# Altium project Mando_V0.PrjPcb
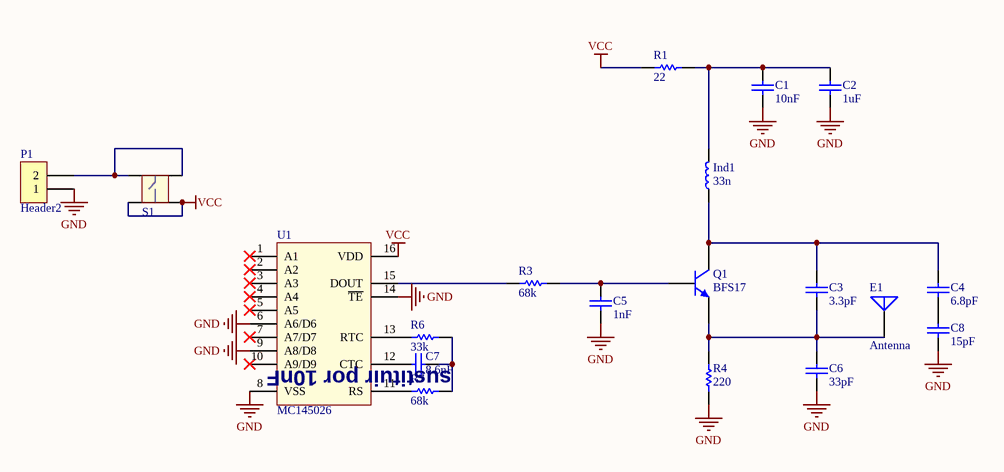
[diagram p0: Mando_v0.SchDoc]
1 sheet, 19 parts. Net scope: global (net labels, ports and power ports of the same name join across sheets).
Board file: Mando_v0.PcbDoc

## Sheet Mando_v0.SchDoc
size A4

### Parts
C1  value 10nF  [0805_CAP]  (hidden comment: Capacitor)
C2  value 1uF  [0805_CAP]  (hidden comment: Capacitor)
C3  value 3.3pF  [0805_CAP]  (hidden comment: Capacitor)
C4  value 6.8pF  [0805_CAP]  (hidden comment: Capacitor)
C5  value 1nF  [0805_CAP]  (hidden comment: Capacitor)
C6  value 33pF  [0805_CAP]  (hidden comment: Capacitor)
C7  value 8.6nF  [CAP0805]  (hidden comment: Capacitor)
C8  value 15pF  [CAP0805]  (hidden comment: Capacitor)
E1  Antenna  [PIN1]
Ind1  Valor: 33n  [IND0603]  (hidden comment: Ind2)
P1  Header2  [HeaderHx2]
Q1  BFS17  [SOT23]
R1  value 22  [0805_RES]  (hidden comment: Resistor)
R3  value 68k  [0805_RES]  (hidden comment: Resistor)
R4  value 220  [0805_RES]  (hidden comment: Resistor)
R6  value 33k  [RES0805]  (hidden comment: Resistor)
R7  value 68k  [RES0805]  (hidden comment: Resistor)
S1  Pulsador  [SW-PB6mm]  (value not drawn)
U1  MC145026  [SOIC127P602-16BN]

### Nets
GND: C1.1 C2.1 C5.1 C6.1 C8.1 P1.1 R4.2 U1.6(A6/D6) U1.8(VSS) U1.9(A8/D8) U1.14(~{TE})
VCC: R1.1 S1.3 S1.4 U1.16(VDD)
NetC1_2: C1.2 C2.2 Ind1.2 R1.2
NetC3_1: C3.1 C6.2 E1.1(A) Q1.2(E) R4.1
NetC3_2: C3.2 C4.2 Ind1.1 Q1.3(C)
NetC4_1: C4.1 C8.2
NetC5_2: C5.2 Q1.1(B) R3.2
NetC7_1: C7.1 R6.2 R7.2
NetC7_2: C7.2 U1.12(CTC)
NetP1_2: P1.2 S1.1 S1.2
NetR3_1: R3.1 U1.15(DOUT)
NetR6_1: R6.1 U1.13(RTC)
NetR7_1: R7.1 U1.11(RS)

Not connected (* = marked no-connect by the designer): U1 1(A1)* 2(A2)* 3(A3)* 4(A4)* 5(A5)* 7(A7/D7)* 10(A9/D9)*

### Notes on the sheet
- (near R7) sustituir por 10nF

### Library data of the parts
C1-C8 = Cap
E1 = Antenna: Generic Antenna; Published: 24-Mar-1999; LatestRevisionDate: 17-Jul-2002; LatestRevisionNote: Re-released for DXP Platform.; PackageReference: PIN1; Publisher: Altium Limited
Q1 = BFS17: NPN 1 GHz Wideband Transistor; Published: 17-Sep-2003; LatestRevisionDate: 12-Dec-2006; LatestRevisionNote: IPC-7351 Footprint Added.; DatasheetVersion: Sep-1995; PackageVersion: May-1999; PackageReference: SOT23; Publisher: Altium Limited; PackageDescription: 3-Pin SOT-23 Package 0.95 mm Pitch, 2.3 mm Lead Span; ComponentLink1Description: Manufacturer Link; ComponentLink1URL: http://www.semiconductors.philips.com/; ComponentLink2Description: Datasheet; ComponentLink2URL: http://www.semiconductors.philips.com/acrobat/datasheets/BFS17_2.pdf
R1 R3 R4 R6 R7 = Res
U1 = MC145026: ENCODER